# EAGLE design January (EAGLE 9.0.1)
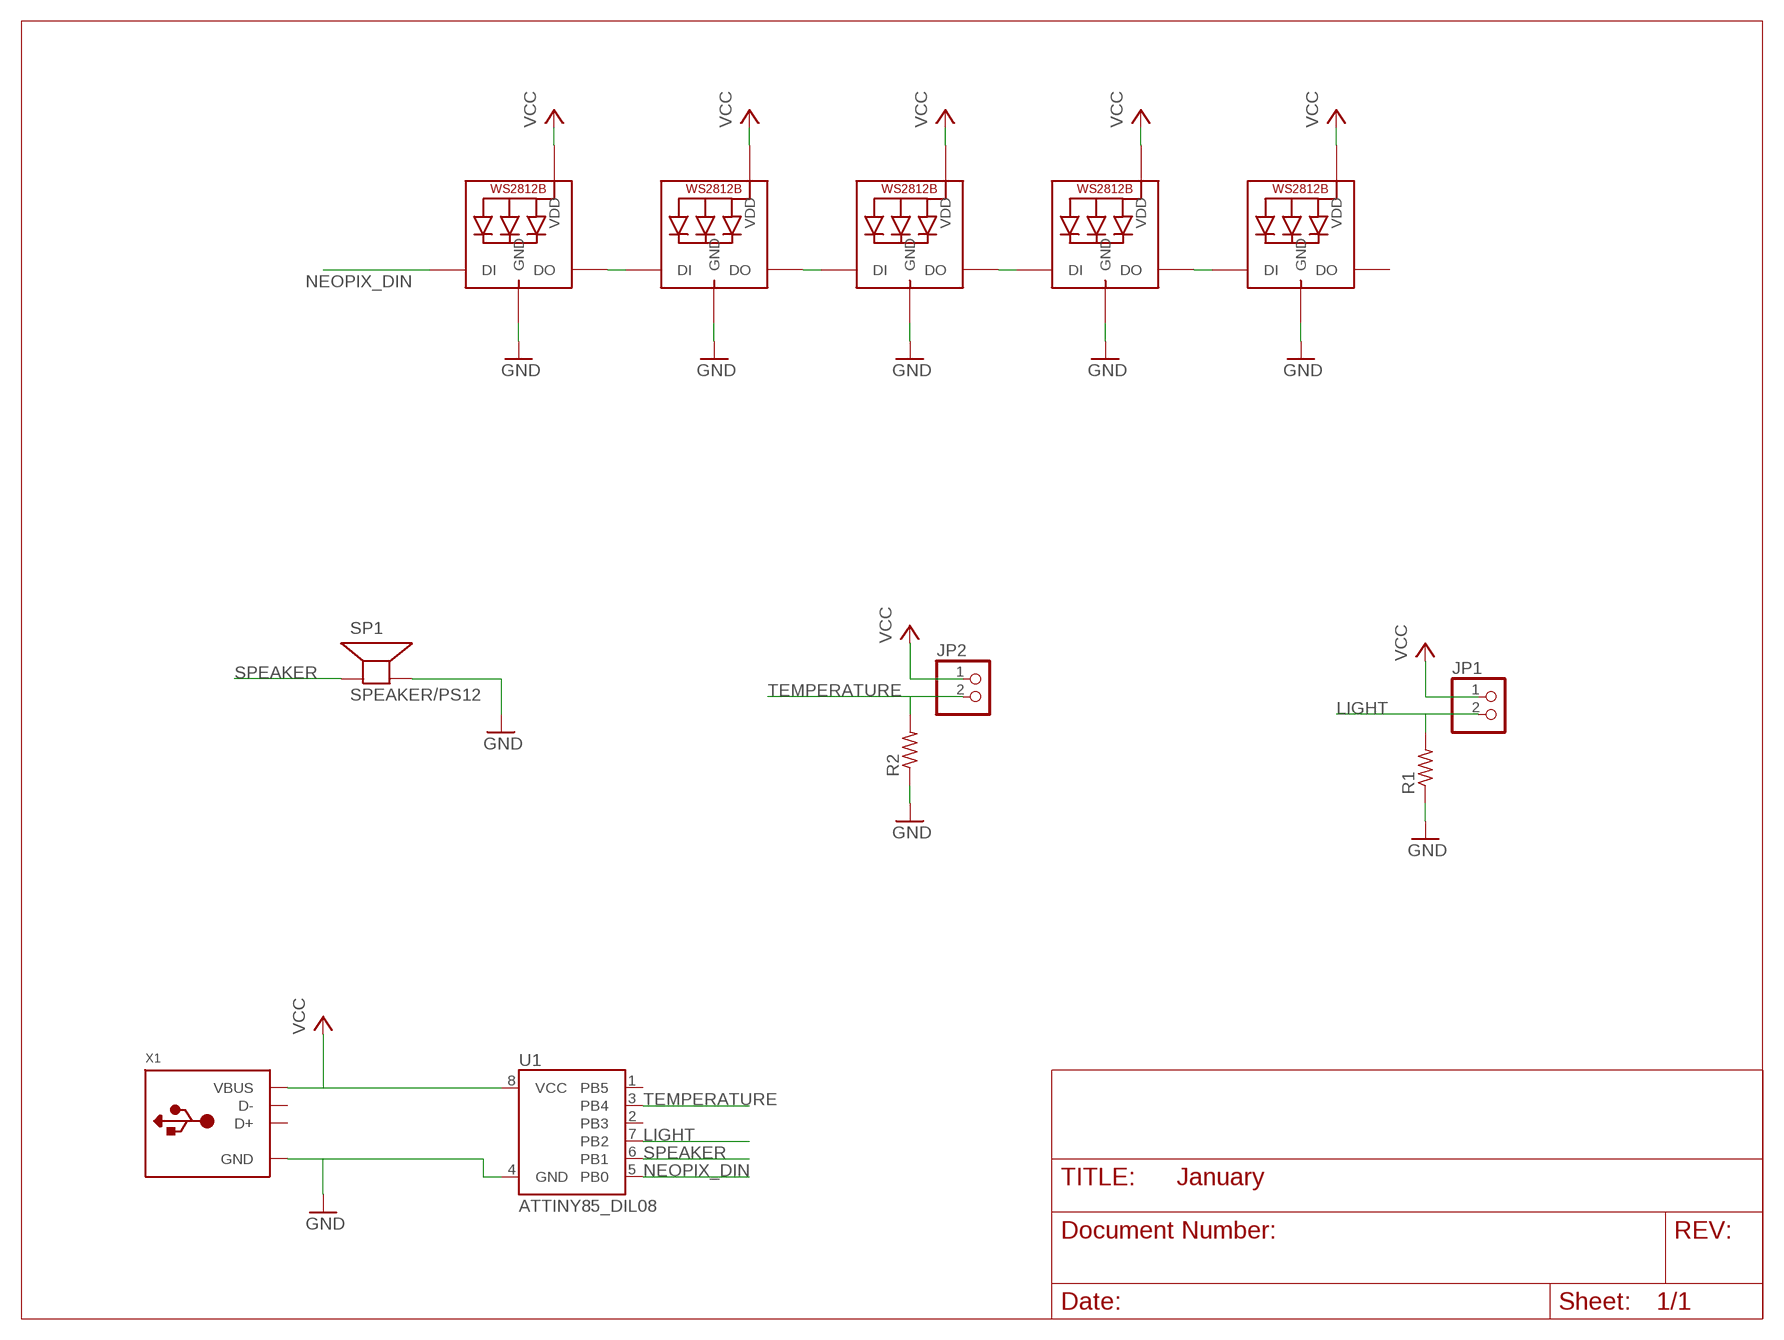
[diagram p0: schematic, sheet 1]

## Parts
JP1  PINHD-1X2  [1X02]
JP2  PINHD-1X2  [1X02]
NEO0  NEOPIXEL_5MM  [LED5MM_4PIN]
NEO1  NEOPIXEL_5MM  [LED5MM_4PIN]
NEO2  NEOPIXEL_5MM  [LED5MM_4PIN]
NEO3  NEOPIXEL_5MM  [LED5MM_4PIN]
NEO4  NEOPIXEL_5MM  [LED5MM_4PIN]
R1  R-US_0207/10  [0207/10]
R2  R-US_0207/10  [0207/10]
SP1  SPEAKER/PS12  [PS12]
U1  ATTINY85_DIL08  [DIL08]
X1  MICROBUILDER_USB_TYPEAPCB  [MICROBUILDER_USBA_PCB]

## Nets
GND: NEO0.G(GND) NEO1.G(GND) NEO2.G(GND) NEO3.G(GND) NEO4.G(GND) R1.1 R2.1 SP1.P$2(-) U1.4(GND) X1.GND
LIGHT: JP1.2 R1.2 U1.7(PB2)
N$1: NEO0.DO NEO1.DI
N$2: NEO1.DO NEO2.DI
N$3: NEO2.DO NEO3.DI
N$4: NEO3.DO NEO4.DI
NEOPIX_DIN: NEO0.DI U1.5(PB0)
SPEAKER: SP1.P$1(+) U1.6(PB1)
TEMPERATURE: JP2.2 R2.2 U1.3(PB4)
VCC: JP1.1 JP2.1 NEO0.5V(VDD) NEO1.5V(VDD) NEO2.5V(VDD) NEO3.5V(VDD) NEO4.5V(VDD) U1.8(VCC) X1.VCC(VBUS)
Unconnected: NEO4.DO U1.1(PB5) U1.2(PB3) X1.USB_NEG(D-) X1.USB_PLUS(D+)

## Library data of the parts
JP1 JP2 = pinhead:PINHD-1X2: PIN HEADER
NEO0 NEO1-NEO4 = LED:NEOPIXEL_5MM
R1 R2 = rcl:R-US_: RESISTOR, American symbol; SPICEPREFIX: R
SP1 = adafruit:SPEAKER: SPEAKER Source: Buerklin Added PS12 (for part # PS1240 piezo) http://www.ladyada.net/library/pcb/eaglelibrary.html
U1 = IC-Microcontroller:ATTINY85_DIL08
X1 = Adafruit pIRkeyboard:MICROBUILDER_USB_TYPEA: USB - Type A Connectors Male types stick out and are inserted into a PC or matching females parts (these are the connectors used on USB Memory Sticks, etc.). Female parts are generally used for USB Host and accept a male-type connector. SMT - 4UCON: 10017 PTHFML - Digikey: 609-1045-ND, 4UCon: 05241 PCB - Use 2.0mm thick PCBs with this footprint

## Board
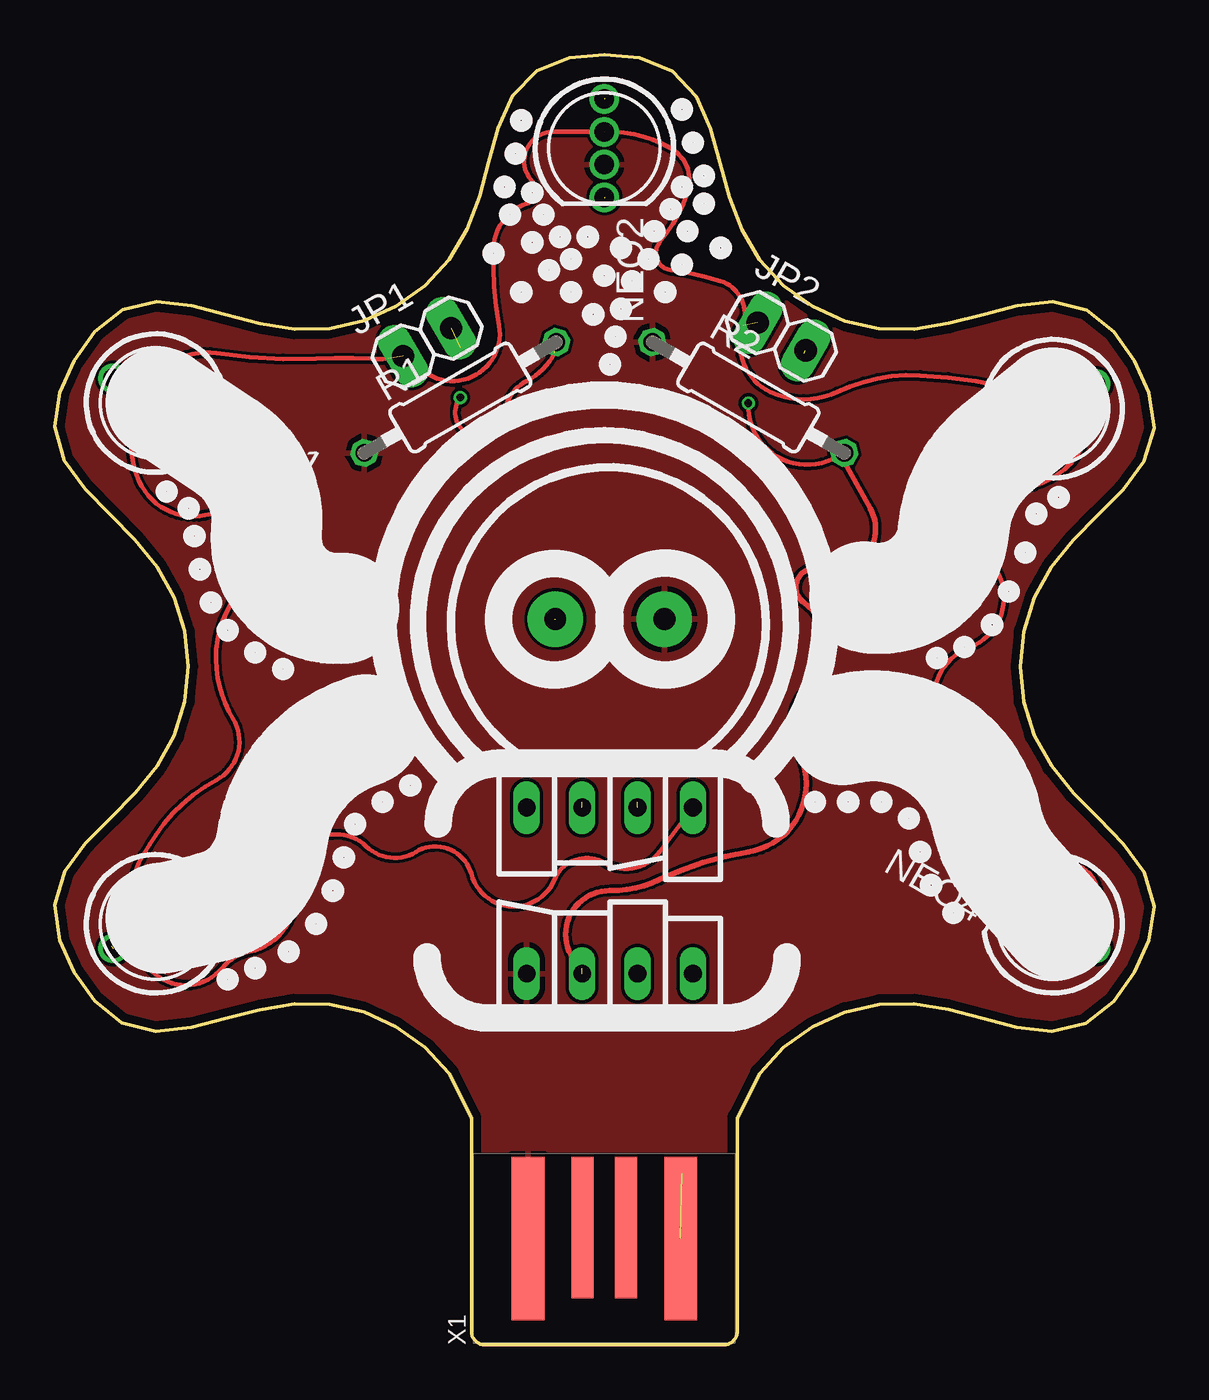
[diagram p1: board, top side]
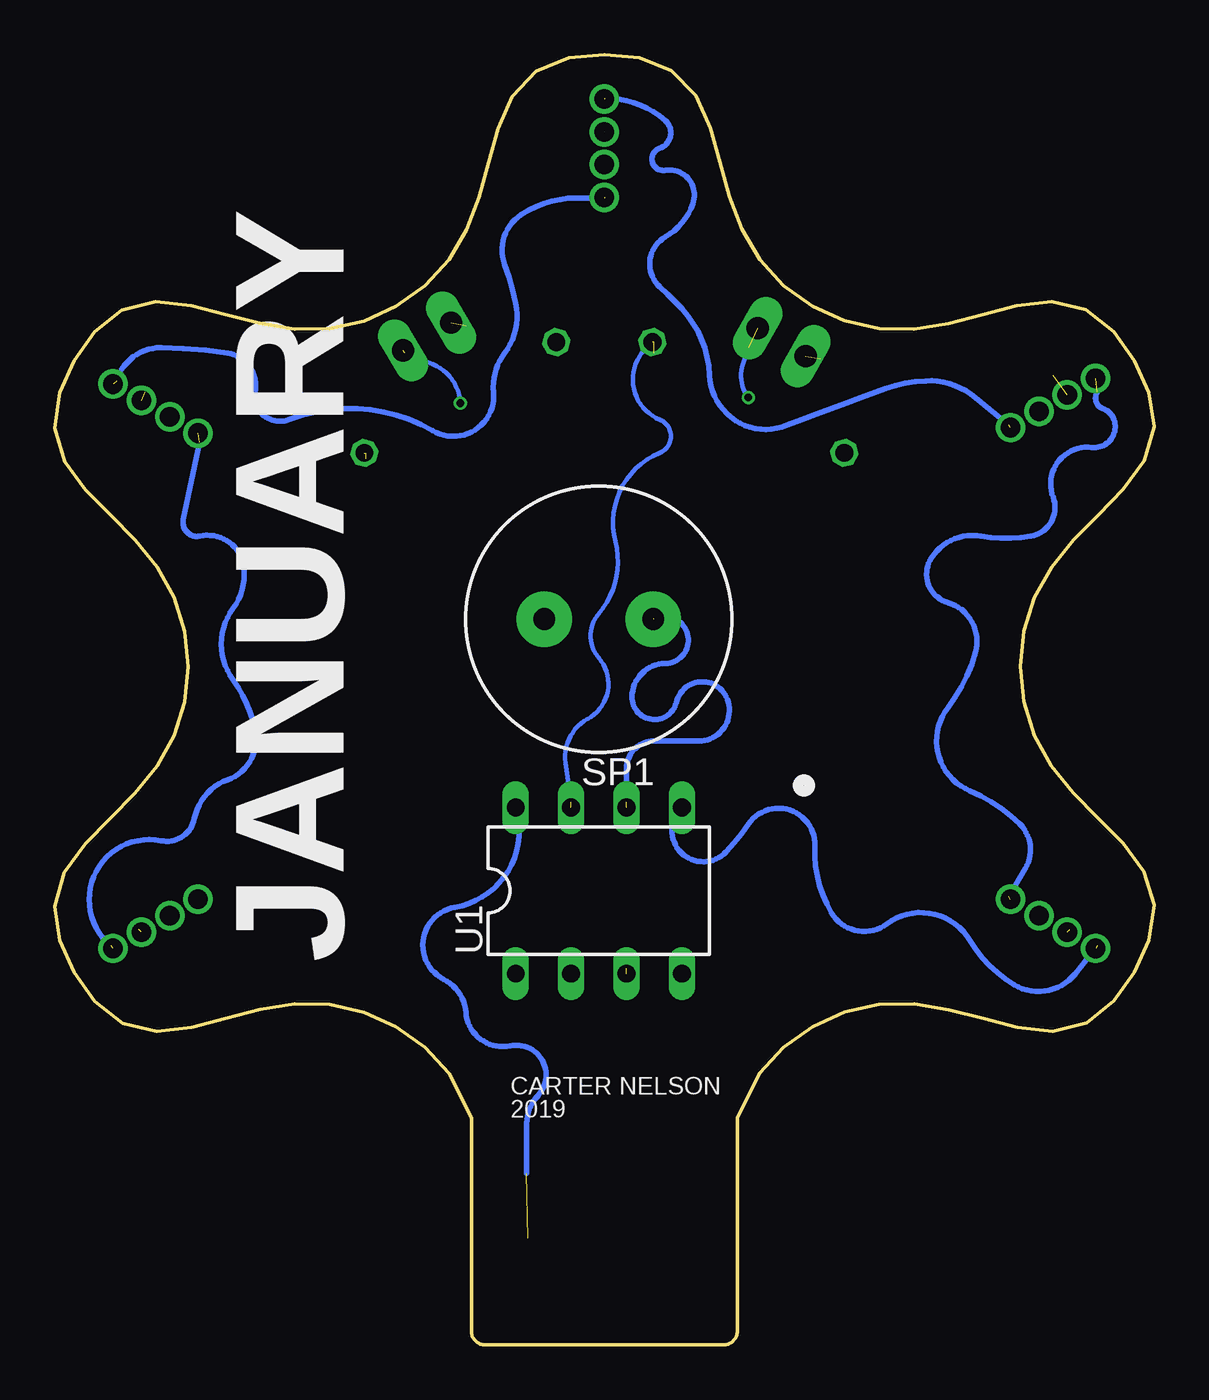
[diagram p2: board, bottom side, seen from below]

Size 50.41 x 59.16 mm. Coordinates in mm from the lower left corner, seen from the top.
Outline: 19.74,0 30.67,0 arc90 31.3,0.64 31.3,10.41 32.33,12.46 33.41,13.64 34.74,14.58 36.22,15.26 37.81,15.61 39.4,15.63 40.97,15.38 42.56,14.96 44.13,14.56 45.72,14.38 47.28,14.75 48.56,15.75 49.5,17.08 50.17,18.54 50.41,20.11 49.97,21.65 49.01,22.98 47.87,24.13 46.73,25.29 45.71,26.54 44.91,27.95 44.44,29.48 44.28,31.1 44.44,32.72 44.92,34.27 45.71,35.66 46.71,36.9 47.86,38.07 48.99,39.22 49.95,40.51 50.41,42.04 50.18,43.66 49.5,45.13 48.57,46.44 47.33,47.44 45.77,47.83 44.14,47.65 42.57,47.24 41,46.84 39.41,46.58 37.79,46.59 36.23,46.95 34.74,47.62 33.42,48.56 32.32,49.76 31.51,51.13 30.94,52.62 30.5,54.21 30.07,55.76 29.43,57.23 28.33,58.4 26.82,59.01 25.21,59.16 23.6,59.01 22.12,58.43 21.01,57.28 20.34,55.78 19.91,54.21 19.48,52.65 18.91,51.14 18.08,49.75 17,48.57 15.67,47.62 14.19,46.95 12.6,46.59 11.01,46.58 9.44,46.83 7.85,47.24 6.28,47.65 4.69,47.83 3.13,47.46 1.85,46.45 0.91,45.13 0.24,43.67 0,42.09 0.44,40.55 1.41,39.23 2.54,38.07 3.68,36.92 4.7,35.67 5.5,34.26 5.97,32.73 6.13,31.1 5.98,29.49 5.49,27.93 4.71,26.55 3.7,25.31 2.55,24.14 1.42,22.99 0.46,21.7 0,20.16 0.23,18.55 0.91,17.08 1.84,15.76 3.09,14.77 4.64,14.38 6.27,14.55 7.84,14.96 9.41,15.37 11,15.63 12.62,15.61 14.18,15.26 15.67,14.58 16.99,13.64 18.09,12.44 19.11,10.41 19.11,0.64 arc90 19.74,0
Copper layers (1*16): Top 0.035559375mm / dielectric 1.6mm / Bottom 0.035559375mm
Design rules "oshpark-2layer": minimum track width 6mil, minimum drill 10mil, track to track 6mil, track to pad 6mil, pad to pad 6mil, via to via 6mil, smd to smd 6mil, copper to edge 15mil, drill to drill 6mil, minimum pad ring 5mil, minimum via ring 5mil, stop-mask expansion 2.5mil, vias tented up to drill 0mil, thermal gap 10mil

### Footprints (pad centres in the part's own frame; a part is rotated, then mirrored left to right if it is on the bottom)
1X02 = drill 1.016 long: 1 -1.27,0; 2 1.27,0
LED5MM_4PIN = drill 0.9: 5V -0.75,0; DI -2.25,0; DO 2.25,0; G 0.75,0
0207/10 = drill 0.813 octagon: 1 -5.08,0; 2 5.08,0
PS12 = drill 1 pad 2.54: P$1 -2.5,0; P$2 2.5,0
DIL08 = drill 0.813 long: 1 -3.81,-3.81; 2 -1.27,-3.81; 3 1.27,-3.81; 4 3.81,-3.81; 5 3.81,3.81; 6 1.27,3.81; 7 -1.27,3.81; 8 -3.81,3.81
MICROBUILDER_USBA_PCB = smd 7.5 x 1.5: GND -0.2,3.5; VCC -0.2,-3.5 | smd 6.5 x 1: USB_NEG 0.3,-1; USB_PLUS 0.3,1

### Placement (x,y rotation side)
JP1  17.08,45.97 30 top
JP2  33.33,46.23 330 top
NEO0  4.63,19.3 30 top
NEO1  4.63,43.18 330 top
NEO2  25.21,54.86 270 top
NEO3  45.78,42.93 210 top
NEO4  45.78,19.3 150 top
R1  18.6,43.43 30 top
R2  31.81,43.43 330 top
SP1  25.46,33.27 180 bottom
U1  25.46,20.83 0 bottom
X1  25.21,5.08 90 top

### Tracks (layer width: path | path; a pad name or v marks a point on that pad's centre or on a via)
GND
  pour Top: 18.86,8.89 15.05,14.22 4.12,13.46 0.31,15.75 -0.7,20.83 5.39,31.5 -0.96,41.15 0.31,45.97 3.62,48.26 15.05,48.01 21.65,59.44 28.76,59.44 35.87,48.01 46.03,48.77 49.84,46.23 51.11,41.4 44.76,30.99 51.11,22.61 50.61,16.26 46.8,13.72 35.62,14.22 31.81,8.89 22.67,8.89 22.41,8.38 21.14,8.38 20.89,8.89
LIGHT  (via drill 0.35)  (4 unrouted)
  Top 0.203: v18.6,43.43 arc214 20.63,42.67 arc-60 21.65,44.2 arc37 22.92,45.47
  Bottom 0.203: 26.73,24.89 26.98,26.67 arc69 25.97,28.7 arc-102 25.46,31.5 arc81 25.46,33.53 arc-55 24.7,36.83 arc82 22.67,40.89 arc-136 22.67,42.42 arc127 22.92,45.97 | 18.6,45.72 18.86,44.96 arc-56 v18.6,43.43
N$1  (2 unrouted)
  Bottom 0.254: 6.66,20.57 5.9,21.84 arc-76 6.16,23.88 arc-22 8.44,25.4 arc105 9.46,29.21 arc-22 8.19,31.75 arc-89 9.46,34.04 arc106 10.22,36.07 arc67 7.93,37.08 arc-19 5.65,37.08 arc-102 4.63,38.86 arc118 2.85,41.15 arc-116 1.84,42.42 arc-51 2.35,42.93 arc104 2.6,43.69
N$2  (2 unrouted)
  Bottom 0.254: 6.66,42.16 8.19,43.43 arc-43 10.47,44.2 arc-19 12.76,43.69 arc3 14.79,42.93 arc-3 16.82,42.16 arc110 20.38,44.45 arc-40 21.65,47.5 arc-4 22.67,48.51 arc107 22.41,50.8 arc-40 21.14,52.32 arc-119 22.41,53.85 arc171 22.67,54.86 arc-120 22.41,56.13 arc-43 25.21,57.15
N$3  (2 unrouted)
  Bottom 0.254: 25.21,52.58 26.48,52.58 arc-33 29.02,51.82 arc-76 29.78,49.53 arc8 29.27,47.75 arc49 29.78,45.47 arc-43 30.29,43.69 arc126 33.08,41.91 arc-33 37.14,42.93 arc-18 39.68,42.42 arc120 41.21,43.69 arc-91 42.48,45.47 arc-8 45.53,45.72 arc-75 47.56,44.2
N$4  (2 unrouted)
  Bottom 0.254: 43.75,41.4 44.51,37.85 arc-114 43.75,37.08 arc98 41.72,35.56 arc40 42.22,33.78 arc-72 42.22,30.48 arc24 41.21,28.19 arc82 42.48,25.91 arc-59 44,24.13 arc90 45.53,23.11 arc-152 47.81,18.29
NEOPIX_DIN  (1 unrouted)
  Bottom 0.254: 2.6,18.29 3.62,17.02 arc82 6.41,16.51 arc29 8.44,18.54 arc-96 12.25,19.3 arc96 14.79,19.81 arc33 15.55,22.86 arc-148 18.6,23.88 arc9 19.62,22.61 arc184 U1.5
SPEAKER  (2 unrouted)
  Bottom 0.254: 24.19,24.89 24.19,26.42 arc90 22.92,27.69 20.89,27.69 arc-116 19.62,29.72 arc-141 21.9,29.46 arc168 23.94,29.72 arc88 22.41,31.24 arc-206 22.92,33.27
TEMPERATURE  (via drill 0.35)  (4 unrouted)
  Top 0.203: v31.81,43.18 arc130 36.13,40.89
  Top 0.254: 36.13,40.64 37.4,38.35 arc-137 35.11,35.56 arc162 34.35,34.04 arc-101 34.6,30.23 arc75 34.1,27.18 arc-109 31.81,22.61 arc17 27.75,21.34 arc-27 25.46,20.83 arc142 24.19,17.27
  Bottom 0.203: 34.35,45.47 33.08,44.96 arc65 v31.81,43.18
VCC  (8 unrouted)
  Top 0.203: U1.8 27.75,22.61 arc-84 25.21,22.1 arc98 22.92,21.34 arc-142 19.11,21.59 arc106 16.57,22.61 arc-75 14.28,22.86 arc145 10.98,21.08 arc-89 8.95,18.03 arc38 7.68,17.27 arc-150 3.87,19.05 3.62,20.57 arc-38 3.87,22.1 arc-5 4.63,23.37 arc-28 7.43,25.91 arc93 8.19,28.7 arc-26 7.43,30.99 arc-52 8.95,35.05 arc154 7.17,38.1 arc-84 3.87,39.62 arc-65 4.63,44.45 arc-57 7.43,45.47 arc11 12,45.21 arc-5 14.54,45.21 arc5 15.3,45.21 arc-42 16.82,44.7 arc42 18.35,44.2 arc98 20.38,46.74 arc-12 20.13,50.29 arc-69 21.65,52.32 arc115 21.9,53.34 arc-135 22.92,55.63 arc3 NEO2.5V arc-31 28.25,54.86 arc-80 29.02,52.83 arc-19 27.75,50.55 arc121 28.25,49.28 arc-10 30.54,48.77 arc-92 31.56,46.74 arc84 32.83,43.69 arc51 35.87,43.69 arc-28 39.68,44.45 arc-10 43.49,43.94 arc78 44.51,44.45 arc-178 46.29,43.69 arc97 46.8,42.67 arc-83 47.3,41.91 arc-44 46.29,40.13 arc-33 43.75,39.12 arc133 42.73,36.07 arc-117 41.97,32 arc89 40.45,28.7 arc92 43.24,27.43 arc-111 44,26.92 arc-18 43.75,25.15 arc83 45.02,22.35 arc25 46.29,22.1 arc-173 46.54,19.05
  Bottom 0.254: 28.76,7.87 28.76,10.16 arc44 28.25,11.43 arc-145 29.52,13.72 arc97 31.56,15.24 arc-58 32.57,16.76 arc143 32.06,20.07 arc-98 U1.8

### Text on the board
bPlace: JANUARY | CARTER NELSON / 2019